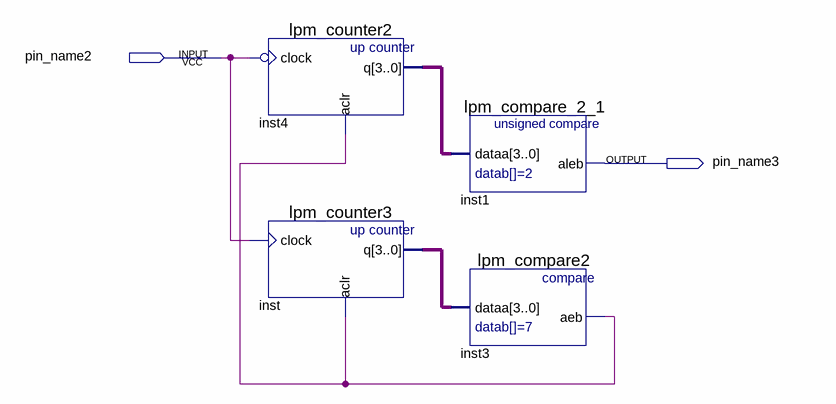
[diagram p0: schematic sheet]
// Quartus schematic Block2.bdf as structural Verilog: 4 symbols, 2 pins
module Block2 (
  input  pin_name2,
  output pin_name3
);

  wire inst3_aeb;
  wire [3:0] inst4_q, inst_q;

  lpm_counter2 inst4 (.clock(~pin_name2), .aclr(inst3_aeb), .q(inst4_q));
  lpm_counter3 inst (.clock(pin_name2), .aclr(inst3_aeb), .q(inst_q));
  lpm_compare_2_1 inst1 (.dataa(inst4_q), .aleb(pin_name3));
  lpm_compare2 inst3 (.dataa(inst_q), .aeb(inst3_aeb));
endmodule
